# EAGLE schematic minimalSchematic (EAGLE 7.3.0)
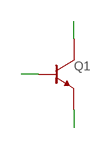
[diagram p0: schematic, sheet 1]

## Parts
Q1  TRANSISTOR-NPN-GENERIC-SOT23-BEC  [SOT23]

## Nets
SIGNAL_BASIS: Q1.P$1(BASE)
SIGNAL_COLLECTOR: Q1.P$3(COLLECTOR)
SIGNAL_EMITTER: Q1.P$2(EMITTER)

## Library data of the parts
Q1 = p.peter-ics:TRANSISTOR-NPN-GENERIC; SPICE_MODEL: test